# EAGLE schematic krokovy motor pokus (EAGLE 7.7.0)
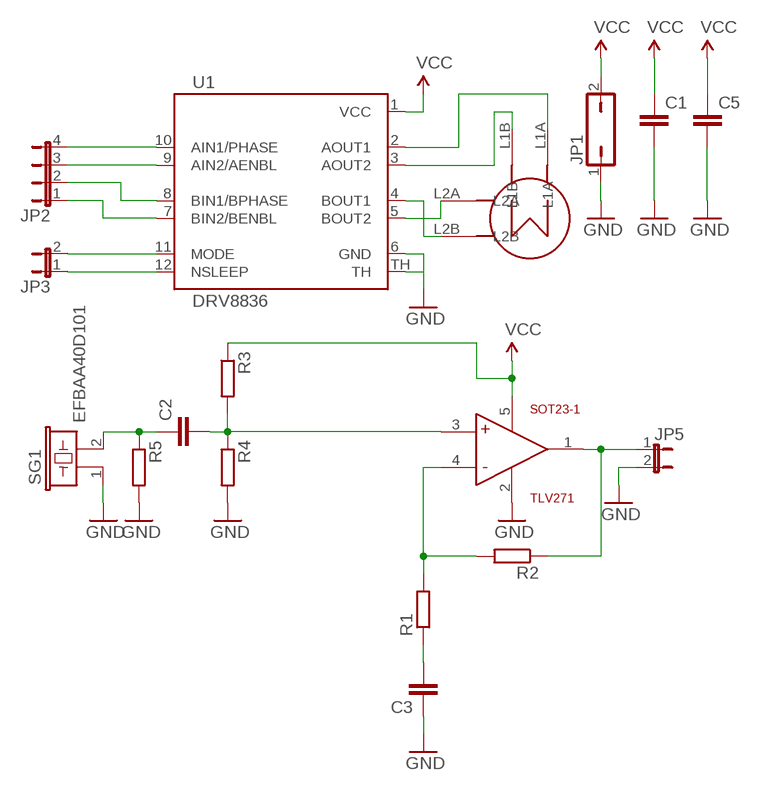
[diagram p0: schematic, sheet 1]

## Parts
C1  CC1206  [C1206]
C2  CC1206  [C1206]
C3  CC1206  [C1206]
C5  CC1206  [C1206]
JP1  JP1Q  [JP1]
JP2  JP4E  [JP4]
JP3  JP1E  [JP1]
JP5  JP1E  [JP1]
R1  RR1206  [R1206]
R2  RR1206  [R1206]
R3  RR1206  [R1206]
R4  RR1206  [R1206]
R5  RR1206  [R1206]
SG1  EFBAA40D101  [EFBAA40D101]
SOT23-1  TLV271  [SOT23-5]
U1  DRV8836  [12WSON]
U$1  STEP_MOTOR  [STEP_MOTOR]

## Nets
GND: C1.2 C3.1 C5.2 JP1.1 JP5.2 R4.2 R5.2 SG1.1 SOT23-1.2(GND) U1.6(GND) U1.TH
N$1: JP2.4 U1.10(AIN1/PHASE)
N$2: JP2.3 U1.9(AIN2/AENBL)
N$3: JP2.2 U1.8(BIN1/BPHASE)
N$4: JP2.1 U1.7(BIN2/BENBL)
N$5: JP3.1 U1.12(NSLEEP)
N$6: JP3.2 U1.11(MODE)
N$7: U1.2(AOUT1) U$1.L1A
N$8: U1.3(AOUT2) U$1.L1B
N$9: U1.5(BOUT2) U$1.L2A
N$10: U1.4(BOUT1) U$1.L2B
N$11: JP5.1 R2.1 SOT23-1.1(OUT)
N$12: R1.2 R2.2 SOT23-1.4(IN-)
N$13: C3.2 R1.1
N$14: C2.2 R3.2 R4.1 SOT23-1.3(IN+)
N$16: C2.1 R5.1 SG1.2
VCC: C1.1 C5.1 JP1.2 R3.1 SOT23-1.5(VDD) U1.1(VCC)

## Library data of the parts
C1-C3 C5 = eagle-ltspice:C: CAPACITOR, European symbol; SPICEMODEL: NONE; SPICEPREFIX: C
JP1 = jumper:JP1Q: JUMPER
JP2 = jumper:JP4E: JUMPER
JP3 JP5 = jumper:JP1E: JUMPER
R1-R5 = eagle-ltspice:R: RESISTOR, European symbol; SPICEMODEL: NONE; SPICEPREFIX: R
SG1 = buzzer:EFB?: Piezoelectric Acoustic Transducer Source: Panbasonic .. 2SC1685.pdf; OC_FARNELL: unknown; OC_NEWARK: unknown
SOT23-1 = texas_instruments:TLV271: TLV271 Single channel 3mhz Op-Amp
U1 = balto:DRV8836: Dual low voltage H-Bridge IC
U$1 = diplomka:STEP_MOTOR